# Altium project Педаль акселератора ПАЭ-5_0.1-А v.2.0.PrjPcb
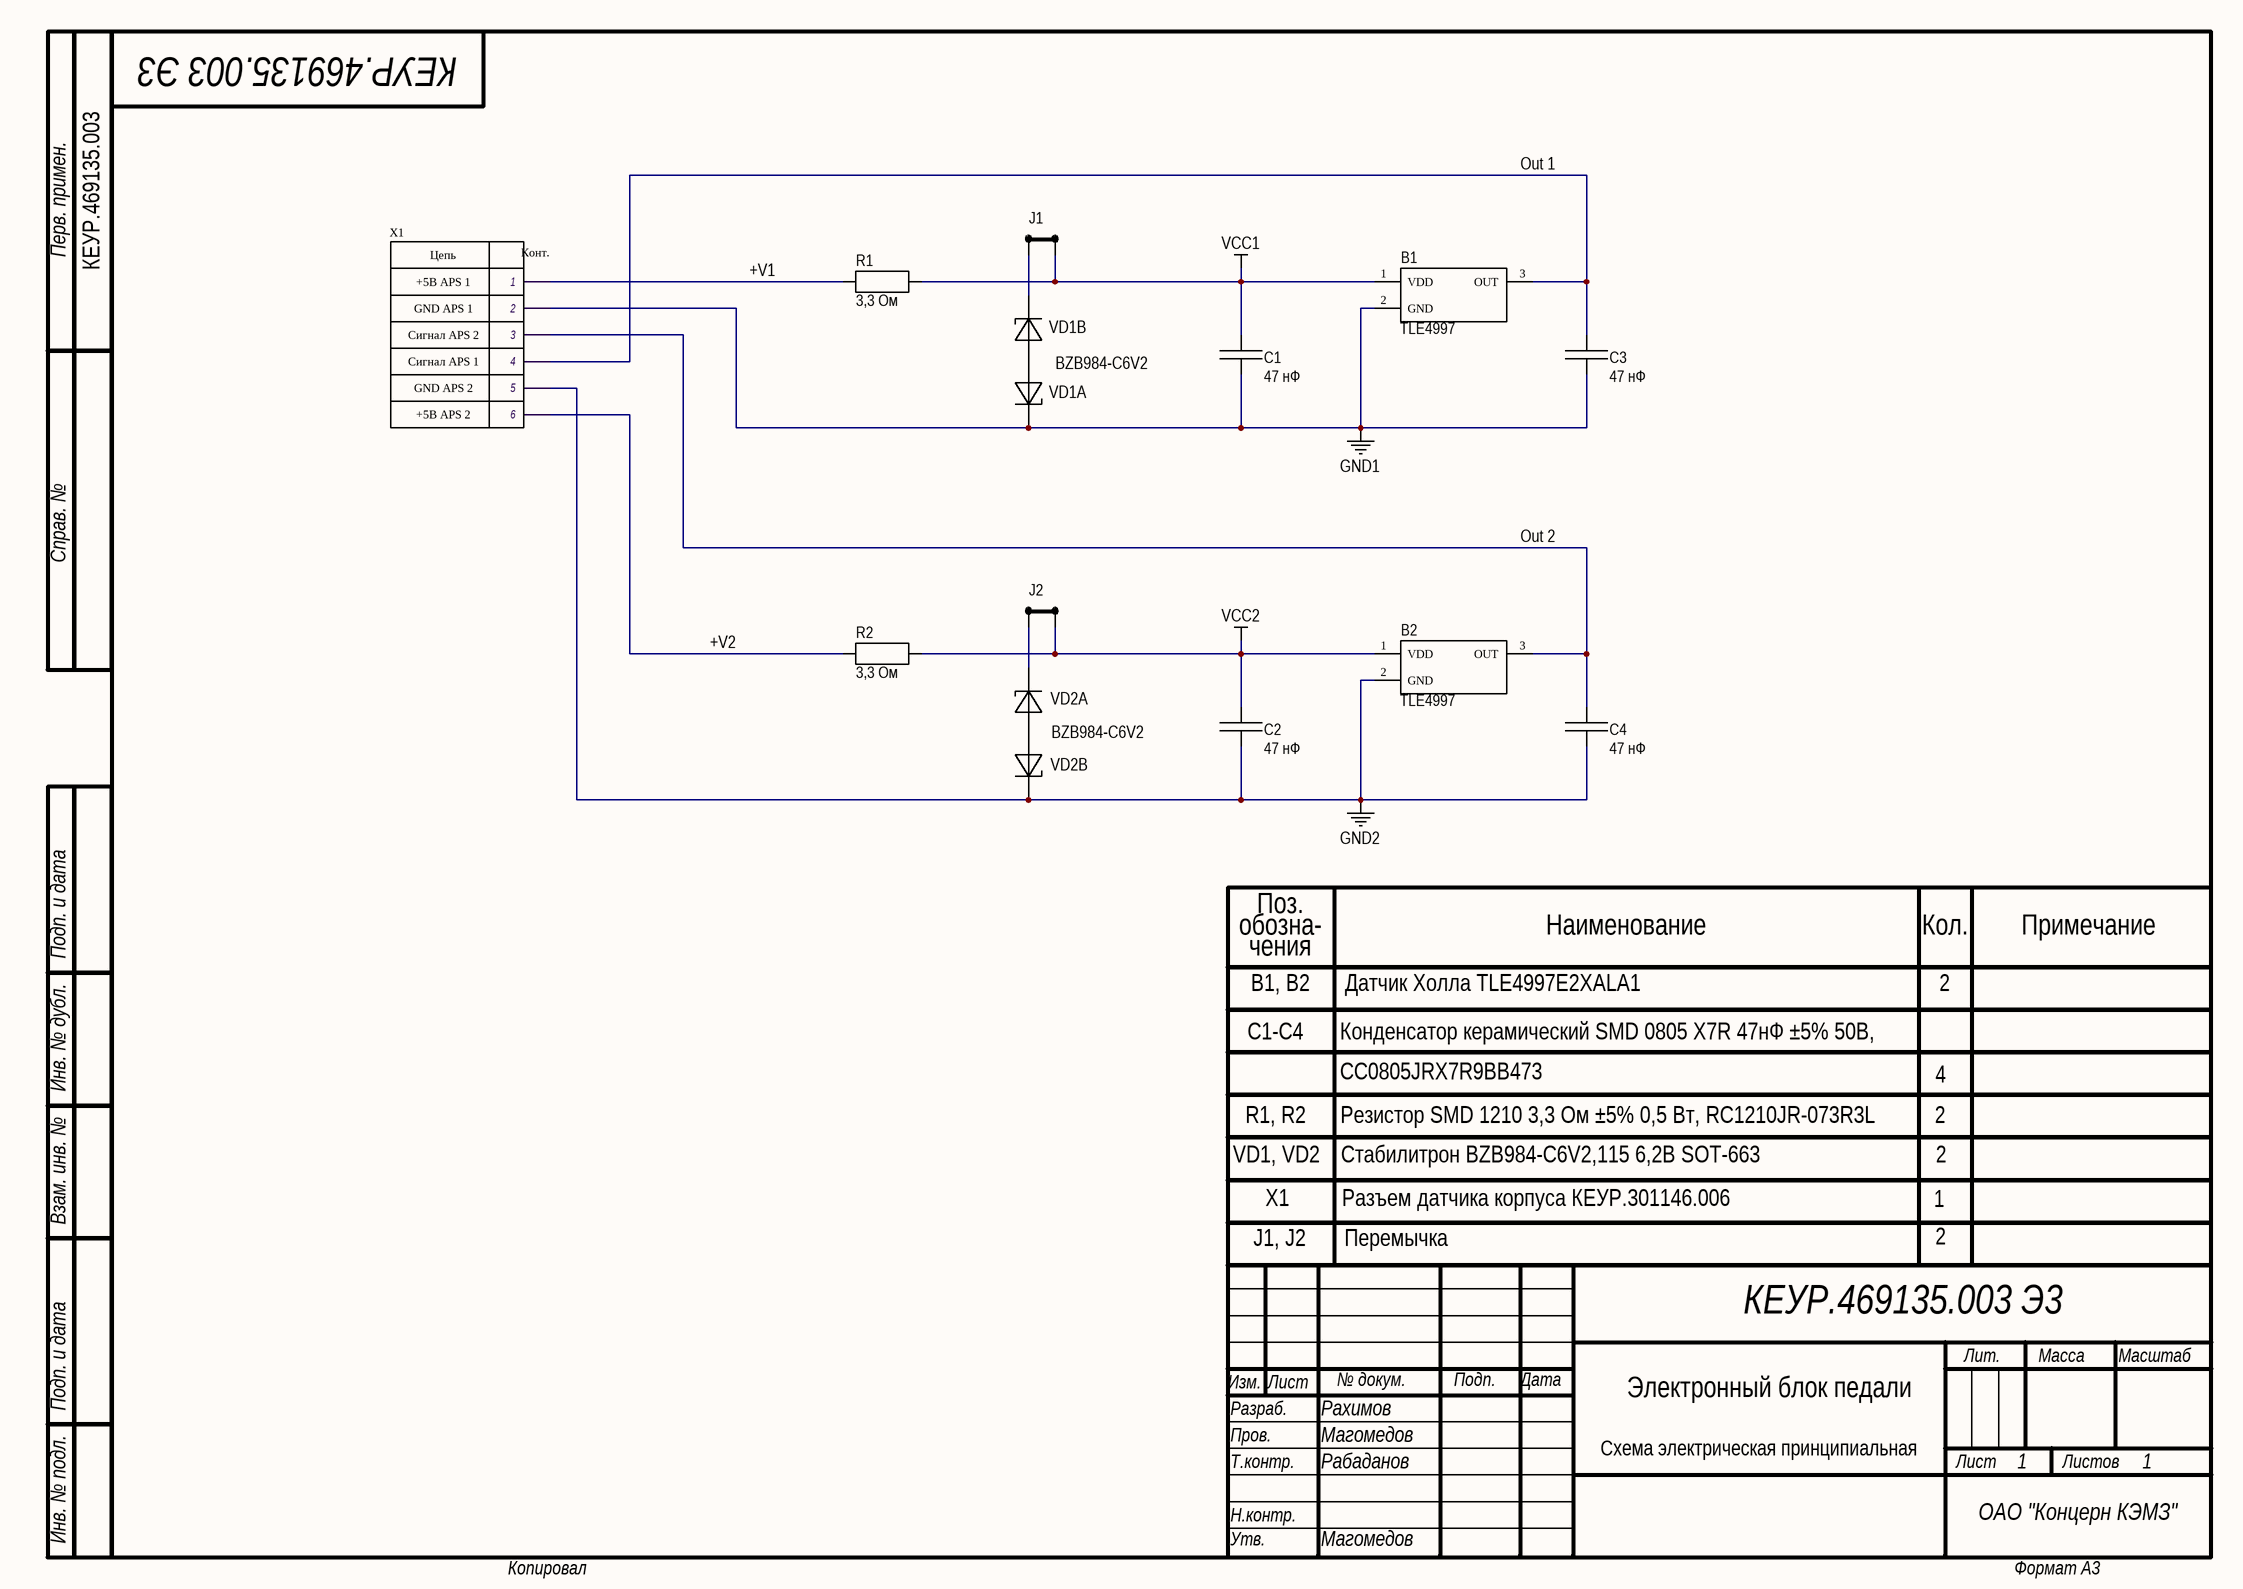
[diagram p0: Электронный блок педали. Схема принципиальная. КЕУР.469135.003Э3.SchDoc]
1 sheet, 13 parts. Net scope: global (net labels, ports and power ports of the same name join across sheets).
Board file: Педаль. Плата..PcbDoc

## Sheet Электронный блок педали. Схема принципиальная. КЕУР.469135.003Э3.SchDoc: Электронный блок педали
size 420 x 297 mm; ApprovedBy: Магомедов; CheckedBy: Магомедов; Author: Рахимов; CompanyName: ОАО "Концерн КЭМЗ"; DocumentNumber: КЕУР.469135.003 Э3; SheetNumber: 1; SheetTotal: 1; Technologist: Рабаданов; Document name: Схема электрическая принципиальная

### Parts
B1  TLE4997  [PG-SSO-3-10]
B2  TLE4997  [PG-SSO-3-10]
C1  47 нФ  [C0805]
C2  47 нФ  [C0805]
C3  47 нФ  [C0805]
C4  47 нФ  [C0805]
J1  (no value)  [J-2x2-2.5]
J2  (no value)  [J-2x2-2.5]
R1  3,3 Ом  [R1210]
R2  3,3 Ом  [R1210]
VD1  BZB984-C6V2  [SOT-663]  (parts A,B of 2)
VD2  BZB984-C6V2  [SOT-663]  (parts A,B of 2)
X1  Конт.1: +5В APS 1  Конт.2: GND APS 1  Конт.3: Сигнал APS 2  Конт.4: Сигнал APS 1  Конт.5: GND APS 2  Конт.6: +5В APS 2  [Датчик ПАЭ-2]

### Nets
GND1: B1.2(GND) C1.1 C3.1 VD1.1(C) X1.2
GND2: B2.2(GND) C2.1 C4.1 VD2.2(C) X1.5
VCC1: B1.1(VDD) C1.2 J1.2 R1.2
VCC2: B2.1(VDD) C2.2 J2.2 R2.2
+V1: R1.1 X1.1
+V2: R2.1 X1.6
Out 1: B1.3(OUT) C3.2 X1.4
Out 2: B2.3(OUT) C4.2 X1.3
NetJ1_1: J1.1 VD1.2(C)
NetJ2_1: J2.1 VD2.1(C)

Not connected (* = marked no-connect by the designer): VD1 3(A); VD2 3(A)

### Notes on the sheet
- КЕУР.469135.003
- Поз.
- обозна-
- Наименование
- Кол.
- Примечание
- B1, B2
- чения
- Датчик Холла TLE4997E2XALA1
- 2
- C1-C4
- Конденсатор керамический SMD 0805 X7R 47нФ ±5% 50В,
- CC0805JRX7R9BB473
- 4
- R1, R2
- Резистор SMD 1210 3,3 Ом ±5% 0,5 Вт, RC1210JR-073R3L
- VD1, VD2
- X1
- Стабилитрон BZB984-C6V2,115 6,2В SOT-663
- Разъем датчика корпуса КЕУР.301146.006
- 1
- J1, J2
- Перемычка
- Перв. примен.
- Справ. №
- Подп. и дата
- Инв. № дубл.
- Взам. инв. №
- Изм.
- Разраб.
- Лист
- № докум.
- Подп.
- Дата
- Лит.
- Масса
- Масштаб
- Пров.
- Т.контр.
- Листов
- Инв. № подл.
- Н.контр.
- Утв.
- Копировал
- Формат А3
- (in symbol Разъем на плате-06) Цепь; Конт.

### Library data of the parts
B1 B2 = TLE4997: Hall Effect Sensor Single Axis PG-SSO-3-92; Manufacture: Infineon Technologies; Model: TLE4997E2XALA1; Name: Датчик Холла; Case: PG-SSO-3-92; HelpURL: https://www.digikey.com/en/products/detail/infineon-technologies/TLE4997E2XALA1/2081764; Value: TLE4997
C1-C4 = Capacity: 0.047 µF ±5% 50V Ceramic Capacitor X7R 0805 (2012 Metric); Manufacture: YAGEO; Model: CC0805JRX7R9BB473; Name: Конденсатор; Voltage: 50 В; HelpURL: https://www.digikey.com/en/products/detail/yageo/CC0805JRX7R9BB473/5884130?s=N4IgTCBcDaIMJwAwA5EFYBSAlAGgdiwE4AhYgFjwGYQBdAXyA; Case: 0805; Value: 47 нФ; Tolerance: ±5%
J1 J2 = Jamper: Name: Перемычка
R1 R2 = Resistor: 20 Ohms ±5% 0.5W, 1/2W Chip Resistor 1210 (3225 Metric) Moisture Resistant Thick Film; Manufacture: YAGEO; Model: RC1210JR-073R3L; Name: Резистор; Power: 0,5Вт; HelpURL: https://www.digikey.com/en/products/detail/yageo/RC1210JR-073R3L/5919943; Case: 1210; Value: 3,3 Ом; Tolerance: ±5%
VD1 VD2 = BZB984-C6V2,115: Zener Diode Array 1 Pair Common Anode 6.2 V 265 mW ±5% SOT-663; Manufacture: NXP Semiconductors; Name: Стабилитрон; Case: SOT-663; HelpURL: https://www.digikey.com/en/products/detail/rochester-electronics-llc/BZB984-C6V2-115/13431733; Value: BZB984-C6V2; Model: BZB984-C6V2,115
X1 = Разъем на плате-06: Name: Разъем